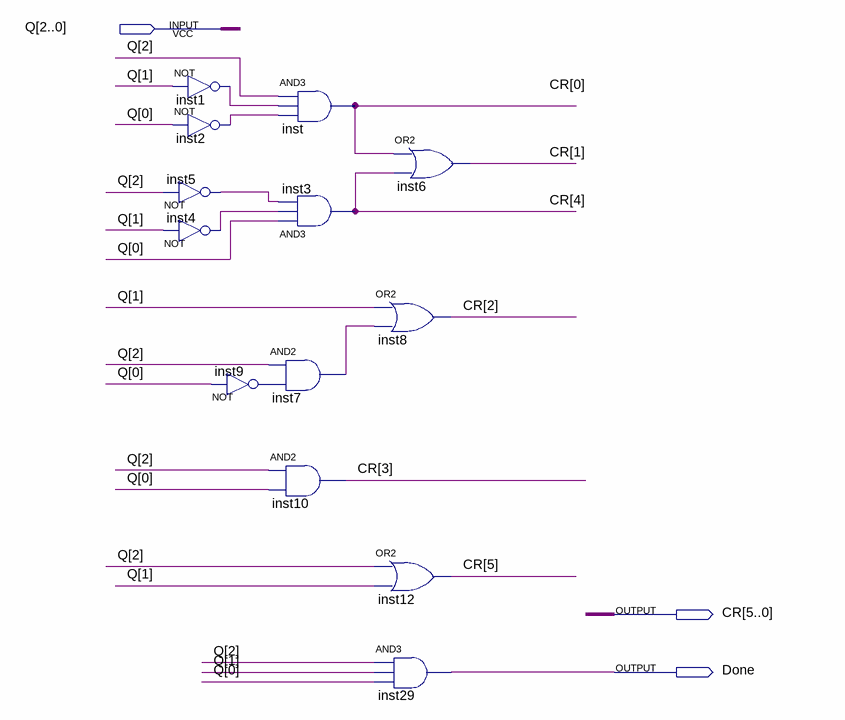
[diagram p0: schematic sheet]
// Quartus schematic Output_logic_version1.bdf as structural Verilog: 13 symbols, 3 pins
module Output_logic_version1 (
  input  [2:0] Q,
  output [5:0] CR,
  output Done
);

  wire inst1_out, inst2_out, inst4_out, inst5_out, inst7_out, inst9_out;

  not inst5 (inst5_out, Q[2]);
  not inst4 (inst4_out, Q[1]);
  not inst1 (inst1_out, Q[1]);
  not inst2 (inst2_out, Q[0]);
  not inst9 (inst9_out, Q[0]);
  and inst (CR[0], Q[2], inst1_out, inst2_out);
  and inst3 (CR[4], Q[0], inst4_out, inst5_out);
  and inst7 (inst7_out, Q[2], inst9_out);
  and inst10 (CR[3], Q[2], Q[0]);
  or inst6 (CR[1], CR[0], CR[4]);
  or inst8 (CR[2], Q[1], inst7_out);
  or inst12 (CR[5], Q[2], Q[1]);
  and inst29 (Done, Q[2], Q[1], Q[0]);
endmodule
